# EAGLE schematic led_analog_watch_face_v1b (EAGLE 5.09)
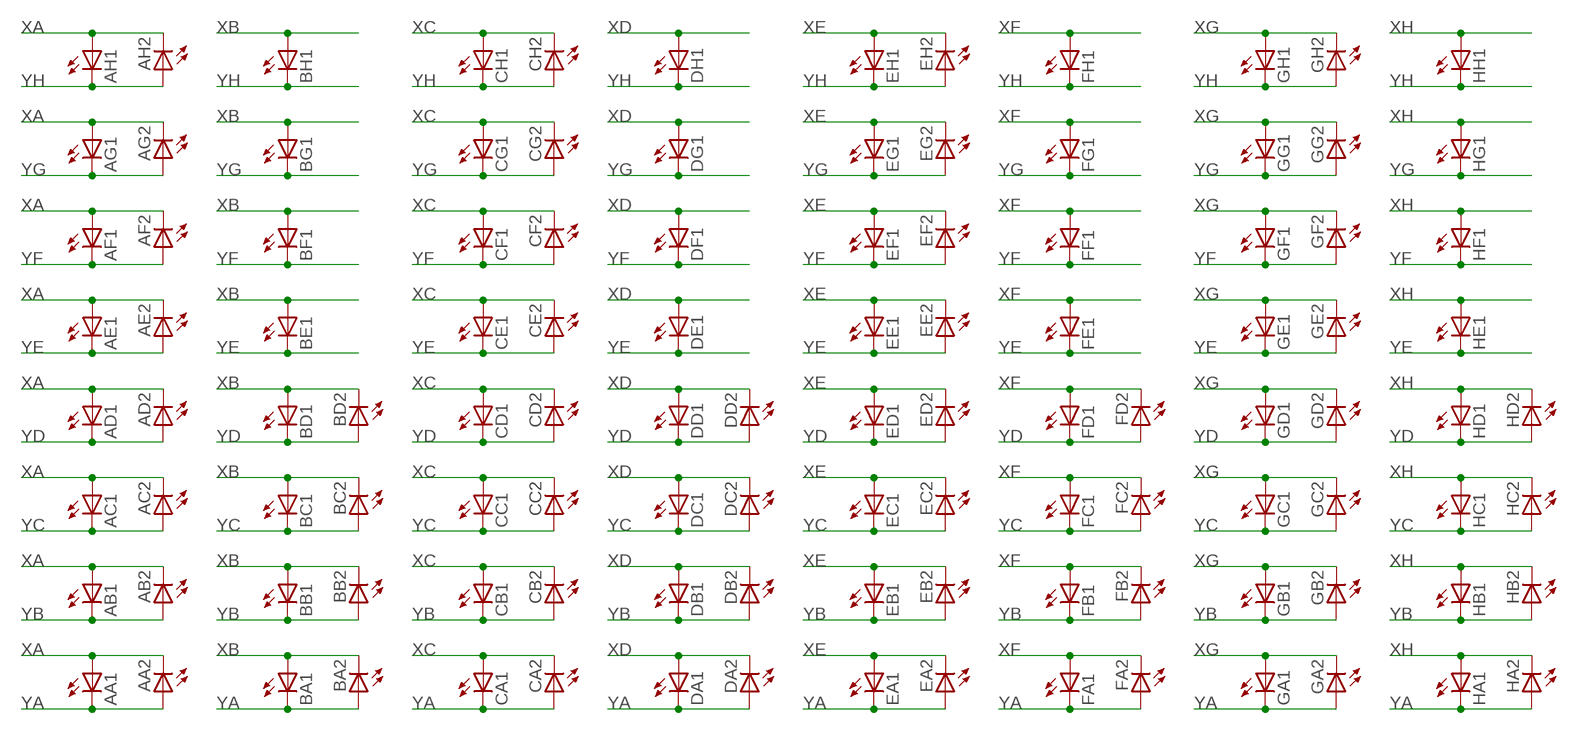
[diagram p0: schematic, sheet 1]

## Parts
AA1  LED0603  [LED-0603]
AA2  LED0603  [LED-0603]
AB1  LED0603  [LED-0603]
AB2  LED0603  [LED-0603]
AC1  LED0603  [LED-0603]
AC2  LED0603  [LED-0603]
AD1  LED0603  [LED-0603]
AD2  LED0603  [LED-0603]
AE1  LED0603  [LED-0603]
AE2  LED0603  [LED-0603]
AF1  LED0603  [LED-0603]
AF2  LED0603  [LED-0603]
AG1  LED0603  [LED-0603]
AG2  LED0603  [LED-0603]
AH1  LED0603  [LED-0603]
AH2  LED0603  [LED-0603]
BA1  LED0603  [LED-0603]
BA2  LED0603  [LED-0603]
BB1  LED0603  [LED-0603]
BB2  LED0603  [LED-0603]
BC1  LED0603  [LED-0603]
BC2  LED0603  [LED-0603]
BD1  LED0603  [LED-0603]
BD2  LED0603  [LED-0603]
BE1  LED0603  [LED-0603]
BF1  LED0603  [LED-0603]
BG1  LED0603  [LED-0603]
BH1  LED0603  [LED-0603]
CA1  LED0603  [LED-0603]
CA2  LED0603  [LED-0603]
CB1  LED0603  [LED-0603]
CB2  LED0603  [LED-0603]
CC1  LED0603  [LED-0603]
CC2  LED0603  [LED-0603]
CD1  LED0603  [LED-0603]
CD2  LED0603  [LED-0603]
CE1  LED0603  [LED-0603]
CE2  LED0603  [LED-0603]
CF1  LED0603  [LED-0603]
CF2  LED0603  [LED-0603]
CG1  LED0603  [LED-0603]
CG2  LED0603  [LED-0603]
CH1  LED0603  [LED-0603]
CH2  LED0603  [LED-0603]
DA1  LED0603  [LED-0603]
DA2  LED0603  [LED-0603]
DB1  LED0603  [LED-0603]
DB2  LED0603  [LED-0603]
DC1  LED0603  [LED-0603]
DC2  LED0603  [LED-0603]
DD1  LED0603  [LED-0603]
DD2  LED0603  [LED-0603]
DE1  LED0603  [LED-0603]
DF1  LED0603  [LED-0603]
DG1  LED0603  [LED-0603]
DH1  LED0603  [LED-0603]
EA1  LED0603  [LED-0603]
EA2  LED0603  [LED-0603]
EB1  LED0603  [LED-0603]
EB2  LED0603  [LED-0603]
EC1  LED0603  [LED-0603]
EC2  LED0603  [LED-0603]
ED1  LED0603  [LED-0603]
ED2  LED0603  [LED-0603]
EE1  LED0603  [LED-0603]
EE2  LED0603  [LED-0603]
EF1  LED0603  [LED-0603]
EF2  LED0603  [LED-0603]
EG1  LED0603  [LED-0603]
EG2  LED0603  [LED-0603]
EH1  LED0603  [LED-0603]
EH2  LED0603  [LED-0603]
FA1  LED0603  [LED-0603]
FA2  LED0603  [LED-0603]
FB1  LED0603  [LED-0603]
FB2  LED0603  [LED-0603]
FC1  LED0603  [LED-0603]
FC2  LED0603  [LED-0603]
FD1  LED0603  [LED-0603]
FD2  LED0603  [LED-0603]
FE1  LED0603  [LED-0603]
FF1  LED0603  [LED-0603]
FG1  LED0603  [LED-0603]
FH1  LED0603  [LED-0603]
GA1  LED0603  [LED-0603]
GA2  LED0603  [LED-0603]
GB1  LED0603  [LED-0603]
GB2  LED0603  [LED-0603]
GC1  LED0603  [LED-0603]
GC2  LED0603  [LED-0603]
GD1  LED0603  [LED-0603]
GD2  LED0603  [LED-0603]
GE1  LED0603  [LED-0603]
GE2  LED0603  [LED-0603]
GF1  LED0603  [LED-0603]
GF2  LED0603  [LED-0603]
GG1  LED0603  [LED-0603]
GG2  LED0603  [LED-0603]
GH1  LED0603  [LED-0603]
GH2  LED0603  [LED-0603]
HA1  LED0603  [LED-0603]
HA2  LED0603  [LED-0603]
HB1  LED0603  [LED-0603]
HB2  LED0603  [LED-0603]
HC1  LED0603  [LED-0603]
HC2  LED0603  [LED-0603]
HD1  LED0603  [LED-0603]
HD2  LED0603  [LED-0603]
HE1  LED0603  [LED-0603]
HF1  LED0603  [LED-0603]
HG1  LED0603  [LED-0603]
HH1  LED0603  [LED-0603]

## Nets
XA: AA1.A AA2.C AB1.A AB2.C AC1.A AC2.C AD1.A AD2.C AE1.A AE2.C AF1.A AF2.C AG1.A AG2.C AH1.A AH2.C
XB: BA1.A BA2.C BB1.A BB2.C BC1.A BC2.C BD1.A BD2.C BE1.A BF1.A BG1.A BH1.A
XC: CA1.A CA2.C CB1.A CB2.C CC1.A CC2.C CD1.A CD2.C CE1.A CE2.C CF1.A CF2.C CG1.A CG2.C CH1.A CH2.C
XD: DA1.A DA2.C DB1.A DB2.C DC1.A DC2.C DD1.A DD2.C DE1.A DF1.A DG1.A DH1.A
XE: EA1.A EA2.C EB1.A EB2.C EC1.A EC2.C ED1.A ED2.C EE1.A EE2.C EF1.A EF2.C EG1.A EG2.C EH1.A EH2.C
XF: FA1.A FA2.C FB1.A FB2.C FC1.A FC2.C FD1.A FD2.C FE1.A FF1.A FG1.A FH1.A
XG: GA1.A GA2.C GB1.A GB2.C GC1.A GC2.C GD1.A GD2.C GE1.A GE2.C GF1.A GF2.C GG1.A GG2.C GH1.A GH2.C
XH: HA1.A HA2.C HB1.A HB2.C HC1.A HC2.C HD1.A HD2.C HE1.A HF1.A HG1.A HH1.A
YA: AA1.C AA2.A BA1.C BA2.A CA1.C CA2.A DA1.C DA2.A EA1.C EA2.A FA1.C FA2.A GA1.C GA2.A HA1.C HA2.A
YB: AB1.C AB2.A BB1.C BB2.A CB1.C CB2.A DB1.C DB2.A EB1.C EB2.A FB1.C FB2.A GB1.C GB2.A HB1.C HB2.A
YC: AC1.C AC2.A BC1.C BC2.A CC1.C CC2.A DC1.C DC2.A EC1.C EC2.A FC1.C FC2.A GC1.C GC2.A HC1.C HC2.A
YD: AD1.C AD2.A BD1.C BD2.A CD1.C CD2.A DD1.C DD2.A ED1.C ED2.A FD1.C FD2.A GD1.C GD2.A HD1.C HD2.A
YE: AE1.C AE2.A BE1.C CE1.C CE2.A DE1.C EE1.C EE2.A FE1.C GE1.C GE2.A HE1.C
YF: AF1.C AF2.A BF1.C CF1.C CF2.A DF1.C EF1.C EF2.A FF1.C GF1.C GF2.A HF1.C
YG: AG1.C AG2.A BG1.C CG1.C CG2.A DG1.C EG1.C EG2.A FG1.C GG1.C GG2.A HG1.C
YH: AH1.C AH2.A BH1.C CH1.C CH2.A DH1.C EH1.C EH2.A FH1.C GH1.C GH2.A HH1.C

## Library data of the parts
AA1 AA2 AB1 AB2 AC1 AC2 AD1 AD2 AE1 AE2 AF1 AF2 AG1 AG2 AH1 AH2 BA1 BA2 BB1 BB2 BC1 BC2 BD1 BD2 BE1 BF1 BG1 BH1 CA1 CA2 CB1 CB2 CC1 CC2 CD1 CD2 CE1 CE2 CF1 CF2 CG1 CG2 CH1 CH2 DA1 DA2 DB1 DB2 DC1 DC2 DD1 DD2 DE1 DF1 DG1 DH1 EA1 EA2 EB1 EB2 EC1 EC2 ED1 ED2 EE1 EE2 EF1 EF2 EG1 EG2 EH1 EH2 FA1 FA2 FB1 FB2 FC1 FC2 FD1 FD2 FE1 FF1 FG1 FH1 GA1 GA2 GB1 GB2 GC1 GC2 GD1 GD2 GE1 GE2 GF1 GF2 GG1 GG2 GH1 GH2 HA1 HA2 HB1 HB2 HC1 HC2 HD1 HD2 HE1 HF1 HG1 HH1 = SparkFun:LED: LEDs Standard schematic elements and footprints for 5mm, 3mm, 1206, and 0603 sized LEDs. 5mm - Spark Fun Electronics SKU : COM-00529 (and others)

## Net classes
0 signal: width 0.203 mm
1 supply: width 0.305 mm